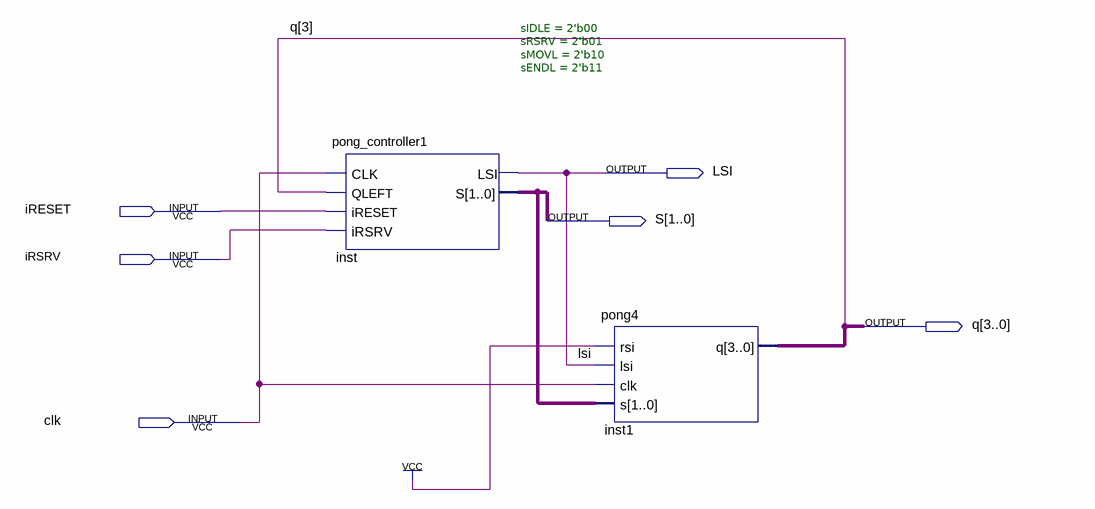
[diagram p0: schematic sheet]
// Quartus schematic PongBlock.bdf as structural Verilog: 2 symbols, 6 pins
module PongBlock (
  input  iRESET,
  input  iRSRV,
  input  clk,
  output LSI,
  output [1:0] S,
  output [3:0] q
);

  pong_controller1 #(.sIDLE(2'b00), .sRSRV(2'b01), .sMOVL(2'b10), .sENDL(2'b11)) inst (
    .CLK(clk), .QLEFT(q[3]), .iRESET(iRESET), .iRSRV(iRSRV), .LSI(LSI), .S(S));
  pong4 inst1 (.rsi(1'b1), .lsi(LSI), .clk(clk), .s(S), .q(q));
endmodule
